# EAGLE design tiny13_charlie4_50mm_AAA_optical_diag_SMT (EAGLE 6.2)
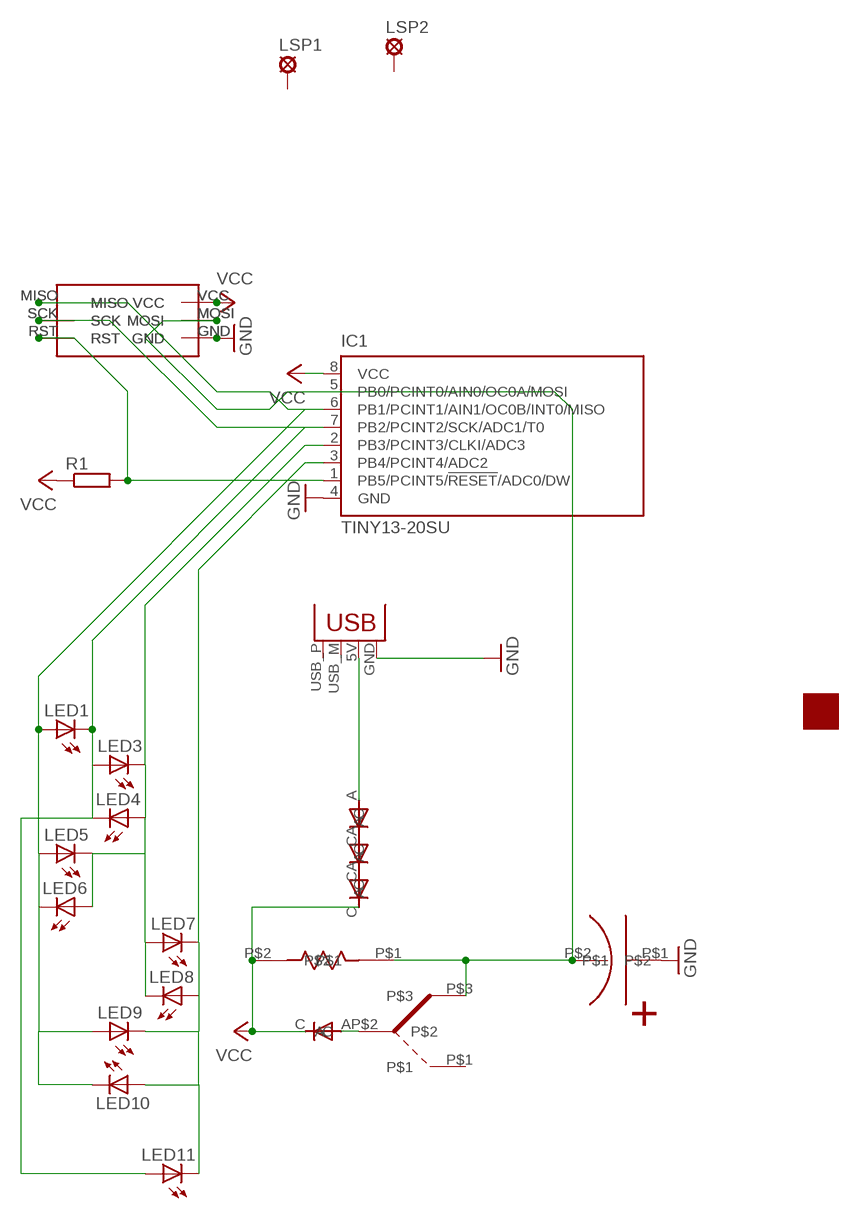
[diagram p0: schematic, sheet 1]

## Parts
IC1  TINY13-20SU  [8S2]
LED1  LED3MM  [LED3MM]
LED3  LED3MM  [LED3MM]
LED4  LED3MM  [LED3MM]
LED5  LED3MM  [LED3MM]
LED6  LED3MM  [LED3MM]
LED7  LED3MM  [LED3MM]
LED8  LED3MM  [LED3MM]
LED9  LED3MM  [LED3MM]
LED10  LED3MM  [LED3MM]
LED11  LED3MM  [LED3MM]
LSP1  LSP10  [LSP10]
LSP2  LSP10  [LSP10]
R1  R-EU_0204/5  [0204/5]
U$1  R-6  [R-6]
U$2  D-6  [D-7.5]
U$3  D-6  [D-7.5]
U$4  AVR_ISP_6_PIN_1X6_SMT_SQUARE_ROUNDED  [CONTACT_ISP_1X6_SQUARE_PAD_ROUNDED]
U$5  NICHICON_12F  [NICHICON_10X30]
U$6  D-6  [D-7.5]
U$7  D-6  [D-7.5]
U$8  SPST_SWITCH_MICRO_PTH  [SPSTMICRO]
U$9  AVR_ISP_6_PIN_1X6_SMT_SQUARE_ROUNDED  [CONTACT_ISP_1X6_SQUARE_PAD_ROUNDED]
U$10  LOGO  [LOGO]
X1  USBPCB  [USB-A-PCB]

## Nets
GND: IC1.4(GND) U$4.GND U$5.P$1 U$9.GND X1.GND
N$1: IC1.2(PB3/PCINT3/CLKI/ADC3) LED3.K(C) LED4.A LED5.K(C) LED6.A LED7.A LED8.K(C)
N$2: IC1.7(PB2/PCINT2/SCK/ADC1/T0) LED1.K(C) LED3.A LED4.K(C) LED11.A U$4.SCK U$9.SCK
N$3: U$7.A U$8.P$2
N$4: IC1.3(PB4/PCINT4/ADC2) LED7.K(C) LED8.A LED9.K(C) LED10.A LED11.K(C)
N$6: IC1.1(PB5/PCINT5/!RESET!/ADC0/DW) R1.2 U$4.RST U$9.RST
N$8: IC1.6(PB1/PCINT1/AIN1/OC0B/INT0/MISO) LED1.A LED5.A LED6.K(C) LED9.A LED10.K(C) U$4.MISO U$9.MISO
N$9: IC1.5(PB0/PCINT0/AIN0/OC0A/MOSI) U$1.P$1 U$4.MOSI U$5.P$2 U$8.P$3 U$9.MOSI
N$11: U$2.C U$3.A
N$12: U$3.C U$6.A
N$13: U$2.A X1.5V(VBUS)
VCC: IC1.8(VCC) R1.1 U$1.P$2 U$4.VCC U$6.C U$7.C U$9.VCC
Unconnected: LSP1.MP LSP2.MP U$8.P$1 X1.USB_M(D-) X1.USB_P(D+)

## Library data of the parts
IC1 = atmel:TINY13: 8-bit AVR Microcontroller with 1K Bytes In-System Programmable Flash Source: http://www.atmel.com/dyn/resources/prod_documents/2535S.pdf; MPN: ATTINY13-20SU; OC_FARNELL: 9171568; OC_NEWARK: 96K6522
LED1 LED3-LED11 = 0-svo:LED: LED OSRAM: - CHIPLED LG R971, LG N971, LY N971, LG Q971, LY Q971, LO R971, LY R971 LH N974, LH R974 LS Q976, LO Q976, LY Q976 LO Q996 - Hyper CHIPLED LW Q18S LB Q993, LB Q99A, LB R99A - SideLED LS A670, LO A670, LY A670, LG A670, LP A670 LB A673, LV A673, LT A673, LW A673 LH A674 LY A675 LS A676, LA A676, LO A676, LY A676, LW A676 LS A679, LY A679, LG A679 - Hyper Micro SIDELED® LS Y876, LA Y876, LO Y876, LY Y876 LT Y87S - SmartLED LW L88C, LW L88S LB L89C, LB L89S, LG L890 LS L89K, LO L89K, LY L89K LS L896, LA L896, LO L896, LY L896 - TOPLED LS T670, LO T670, LY T670, LG T670, LP T670 LSG T670, LSP T670, LSY T670, LOP T670, LYG T670 LG T671, LOG T671, LSG T671 LB T673, LV T673, LT T673, LW T673 LH T674 LS T676, LA T676, LO T676, LY T676, LB T676, LH T676, LSB T676, LW T676 LB T67C, LV T67C, LT T67C, LS T67K, LO T67K, LY T67K, LW E67C LS E67B, LA E67B, LO E67B, LY E67B, LB E67C, LV E67C, LT E67C LW T67C LS T679, LY T679, LG T679 LS T770, LO T770, LY T770, LG T770, LP T770 LB T773, LV T773, LT T773, LW T773 LH T774 LS E675, LA E675, LY E675, LS T675 LS T776, LA T776, LO T776, LY T776, LB T776 LHGB T686 LT T68C, LB T68C - Hyper Mini TOPLED® LB M676 - Mini TOPLED Santana® LG M470 LS M47K, LO M47K, LY M47K Source: http://www.osram.convergy.de/
LSP1 LSP2 = solpad:LSP10: SOLDER PAD drill 1.0 mm, distributor Buerklin, 12H555
R1 = resistor:R-EU_: RESISTOR, European symbol
U$1 = Mrule:R-6
U$2 U$3 U$6 U$7 = Mrule:D-6
U$4 U$9 = Mrule:AVR_ISP_6_PIN_1X6_SMT_SQUARE_ROUNDED
U$5 = Mrule:NICHICON_12F
U$8 = Mrule:SPST_SWITCH_MICRO_PTH
U$10 = mrule2:LOGO
X1 = SparkFun:USB: USB Connectors USB-B-PTH is fully proven SKU : PRT-00139 USB-miniB is fully proven SKU : PRT-00587 USB-A-PCB is untested. USB-A-H is throughly reviewed, but untested. Spark Fun Electronics SKU : PRT-00437 USB-B-SMT is throughly reviewed, but untested. Needs silkscreen touching up. USB-A-S has not been used/tested USB-MB-H has not been used/tested

## Board
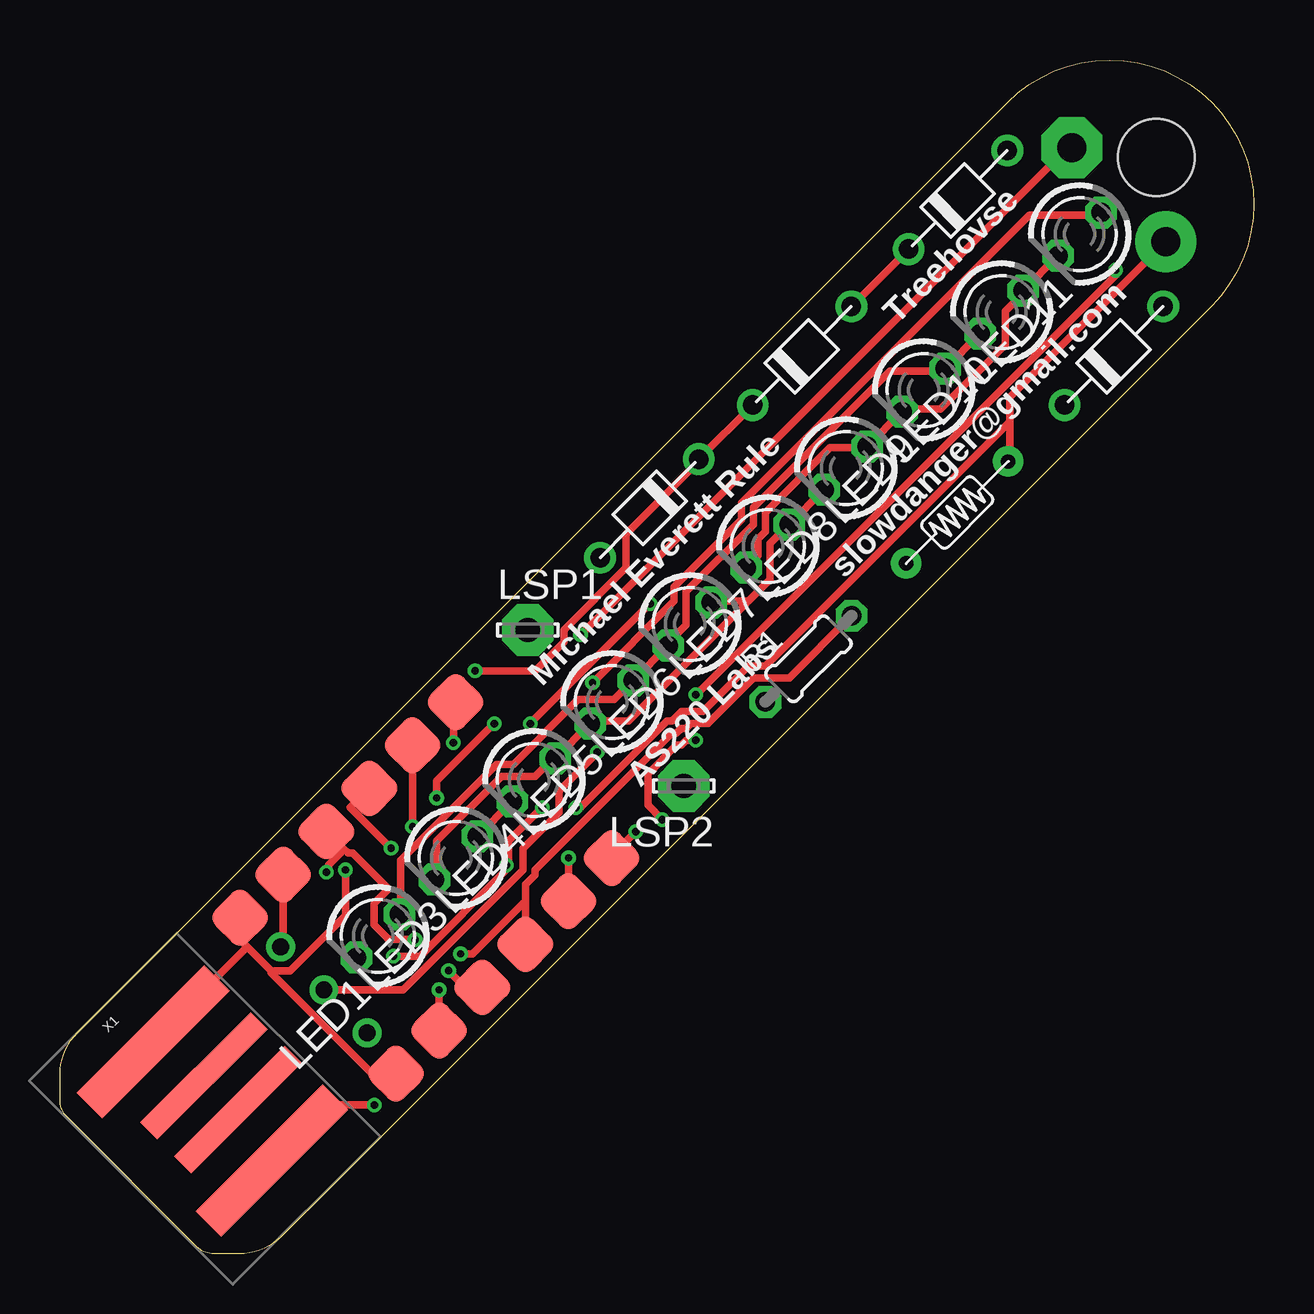
[diagram p1: board, top side]
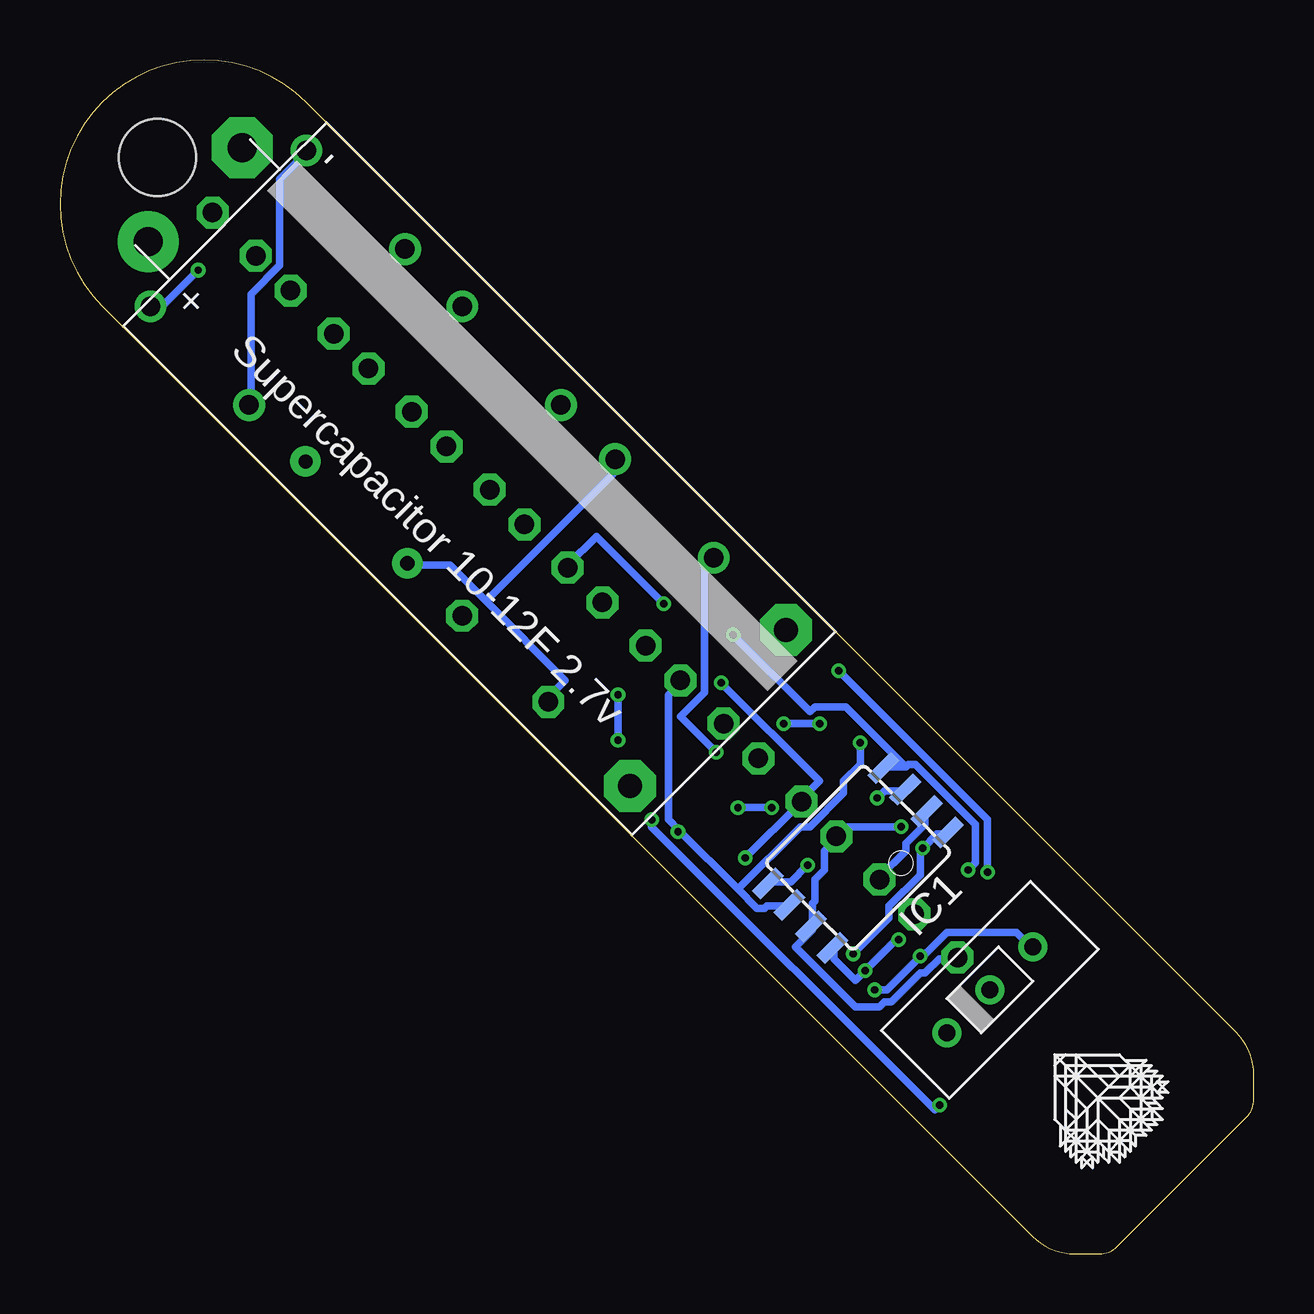
[diagram p2: board, bottom side, seen from below]

Size 49.76 x 49.76 mm. Coordinates in mm from the lower left corner, seen from the top.
Outline: 0.73,9.23 39.5,48 arc-180 48,39.5 9.23,0.73 arc-45 7.46,0 6.41,0 arc-45 5.71,0.29 0.29,5.71 arc-45 0,6.41 0,7.46 arc-45 0.73,9.23
Copper layers (1*16): Top 0.035mm / dielectric 1.5mm / Bottom 0.035mm
Design rules: minimum track width 12mil, minimum drill 12mil, track to track 7mil, track to pad 7mil, pad to pad 7mil, via to via 7mil, smd to smd 0mil, copper to edge 20mil, drill to drill 10mil, minimum pad ring 10mil, minimum via ring 6mil, stop-mask expansion 2mil, vias tented up to drill 100mil, thermal gap 10mil
Holes 3.2 mm at 45.7,45.7

### Footprints (pad centres in the part's own frame; a part is rotated, then mirrored left to right if it is on the bottom)
8S2 = smd 0.5 x 1.4: 1 -1.905,-3.404; 2 -0.645,-3.404; 3 0.625,-3.404; 4 1.895,-3.404; 5 1.905,3.404; 6 0.635,3.404; 7 -0.635,3.404; 8 -1.905,3.404
LED3MM = drill 0.813 octagon: A -1.27,0; K 1.27,0
LSP10 = drill 1.016 pad 2.159 octagon: MP 0,0
0204/5 = drill 0.813 octagon: 1 -2.54,0; 2 2.54,0
R-6 = drill 0.6 pad 1.27: P$1 -3,0; P$2 3,0
D-7.5 = drill 0.813: A 2.81,0; C -3,0
CONTACT_ISP_1X6_SQUARE_PAD_ROUNDED = smd 1.93 x 1.93: GND 6.35,0; MISO -6.35,0; MOSI 3.81,0; RST -1.27,0; SCK -3.81,0; VCC 1.27,0
NICHICON_10X30 = drill 1.2 pad 2.54 octagon: P$1 3.23,-1.75 | drill 1.2 pad 2.54: P$2 8.77,-1.75
SPSTMICRO = drill 0.7: P$1 -2.54,0; P$2 0,0; P$3 2.54,0
USB-A-PCB = smd 7.5 x 1.5: 5V -0.2,-3.5; GND -0.2,3.5 | smd 6.5 x 1: USB_M 0.3,-1; USB_P 0.3,1

### Placement (x,y rotation side)
IC1  16.5,16.5 135 bottom
LED1  13.25,13.25 225 top
LED3  16.5,16.5 225 top
LED4  19.75,19.75 225 top
LED5  23,23 225 top
LED6  26.25,26.25 225 top
LED7  29.5,29.5 225 top
LED8  32.75,32.75 225 top
LED9  36,36 225 top
LED10  39.25,39.25 225 top
LED11  42.5,42.5 225 top
LSP1  19.5,26 0 top
LSP2  26,19.5 180 top
R1  31.2,24.8 45 top
U$1  37.4,30.9 225 top
U$2  44,37.5 45 top
U$3  37.5,44 45 top
U$4  18.5,12 225 top
U$5  38.65,47.15 225 bottom
U$6  31,37.5 45 top
U$7  24.5,31 225 top
U$8  11,11 45 bottom
U$9  12,18.5 225 top
U$10  6.5,6.5 225 bottom
X1  6.5,6.5 45 top

### Tracks (layer width: path | path; a pad name or v marks a point on that pad's centre or on a via)
GND  (via drill 0.3)
  Top 0.305: v11.9,16 11.9,14.1 9.6,11.8 8.8,11.8 | 7.8,12.8 7.1,13.5 7.6,14 U$9.GND | 7.8,12.8 8.8,11.8 | U$4.GND 14,7.6 12.9,7.6 8.8,11.7 8.8,11.8 | v21.7,25.8 42,46.1 42.1,46.1 U$5.P$1 | 7.8,12.8 3.9,8.9 X1.GND
  Bottom 0.305: 14.6,20.3 14.5,20.3 14.4,20.4 14.1,20.4 11.6,17.9 11.6,16.3 v11.9,16 | 14.6,20.3 15.4,20.3 IC1.4 | v21.7,25.8 18.5,22.6 18.3,22.8 17,22.8 14.6,20.4 14.6,20.3
N$1
  Top 0.305: 28.6,27.2 28.7,27.2 29.6,28.1 29.6,29.6 LED7.A LED8.K | 28.6,27.2 27.2,27.2 LED6.A | 28.6,27.2 28.6,27.1 23.7,22.2 22.2,22.2 LED5.K LED4.A 20.5,20.6 19.8,19.9 18.4,19.9 15.7,17.2 15.7,15.7 LED3.K
  Bottom 0.305: IC1.2 13.7,18.4 13.7,17.9 14.5,17.1 14.5,16.8 15.6,15.7 LED3.K
N$2  (via drill 0.3)
  Top 0.305: v14.7,17.8 14.7,21.1 U$9.SCK | v21.2,16.5 U$4.SCK | v22.2,23.8 25.6,27.2 25.6,27.8 28.4,30.6 28.4,31.3 40.4,43.3 43.3,43.3 LED11.A | LED4.K LED3.A
  Bottom 0.305: v14.7,17.8 17,17.8 17.3,17.5 LED3.A 17.4,17.3 17.9,16.8 17.9,16 18.3,15.6 18.3,14.7 18.4,14.6 18.4,13.7 IC1.7 18.4,13.5 19.1,12.8 16.6,10.3 15.6,10.3 15.4,10.5 15.1,10.5 13.9,11.7 13.7,11.7 13.1,12.3 12.4,12.3 LED1.K | v21.2,16.5 18.9,18.8 LED4.K 18.8,19 18.1,19.7 v22.2,23.8
N$3  (via drill 0.3)
  Top 0.305: U$8.P$2 14.3,11 19.3,16 19.3,16.9 20.8,18.4 20.8,19.3 v22.4,20.9
  Bottom 0.305: v22.4,20.9 23.9,22.4 22.9,23.4 22.9,28.7 22.6,29 U$7.A
N$4  (via drill 0.3)
  Top 0.305: LED11.K LED10.A 40.1,40 39.4,39.3 39.4,37.9 36.7,35.2 35.2,35.2 LED9.K LED8.A 33.5,33.6 32.1,33.6 29.4,30.9 29.4,30.1 29.1,29.8 29.1,29.1 LED7.K | v15.7,19 15.7,19.7 v18.1,22.1 | v24.6,27.1 v19.6,22.1
  Bottom 0.305: v15.7,19 15.4,19.3 14.6,19.3 IC1.3 | v19.6,22.1 v18.1,22.1 | v24.6,27.1 27.4,29.9 28.6,28.7 LED7.K
N$6  (via drill 0.3)
  Top 0.305: v13.8,16.9 12.1,18.6 U$9.RST | 19.4,14.6 19.4,15.4 19.8,15.8 19.8,16 25.5,21.7 25.7,21.7 25.9,21.9 26.1,21.9 26.3,22.1 27,22.1 28.9,24 30.4,24 R1.2 | 19.4,14.6 U$4.RST | v16.7,12.5 17.2,12.5 19.3,14.6 19.4,14.6
  Bottom 0.305: IC1.1 12.8,17.5 13.2,17.5 v13.8,16.9 13.9,16.8 13.9,15.8 15.2,14.5 15.2,14 v16.7,12.5
N$8  (via drill 0.3)
  Top 0.305: LED10.K LED9.A 36.8,36.8 34.6,36.8 28.9,31.1 28.9,30.4 26.1,27.6 26.1,26.2 25.4,25.5 LED6.K LED5.A 23.1,23.1 21.6,23.1 18.9,20.4 18.2,20.4 14.2,16.4 14.2,14.2 LED1.A | v24,17.6 23,16.6 U$4.MISO | v16.4,21.3 16.4,22.9 U$9.MISO
  Bottom 0.305: 23.95,17.65 24.4,18.1 24.4,23.3 23.9,23.8 LED5.A | 23.95,17.65 21.5,15.2 | 21.5,15.2 20.7,14.4 20.4,14.4 20.3,14.5 19.4,14.5 IC1.6 | v24,17.6 23.95,17.65 | v16.4,21.3 16.4,20.4 17.1,19.7 17.1,19.2 18.5,17.8 18.9,17.8 21.5,15.2
N$9  (via drill 0.3)
  Top 0.305: v13.9,12.4 15,12.4 18.6,16 v18.6,16.2 18.7,16.3 18.7,17.2 v20.1,18.6 | U$9.MOSI 9.3,12.8 U$8.P$3 | v15.8,11 15.8,9.4 U$4.MOSI | 39.6,34.6 39.6,35.7 46,42.1 U$5.P$2 | 39.6,34.6 39.6,33.1 U$1.P$1 | v21.5,18.6 21.7,18.6 25.3,22.2 25.5,22.2 25.9,22.6 26.8,22.6 28.7,24.5 29.4,24.5 39.5,34.6 39.6,34.6
  Bottom 0.305: v18.6,16.2 19.3,15.5 20.2,15.5 IC1.5 | U$8.P$3 9.3,12.8 9.9,13.4 12.8,13.4 13.8,12.4 v13.9,12.4 15.3,11 v15.8,11 | v21.5,18.6 v20.1,18.6
N$11
  Bottom 0.305: U$2.C 41.8,35.4 41.8,40 40.6,41.2 40.6,44.8 39.5,45.9 U$3.A
N$12
  Top 0.305: U$3.C U$6.A
N$13  (via drill 0.3)
  Top 0.305: v44,41 44,40.8 v26.5,23.3 | v26.5,21.4 26.1,21.4 25.9,21.2 25.7,21.2 24.5,20 24.5,18.7 v25.1,18.1 | v13.1,6.2 11.2,6.2 8.9,3.9 X1.5V
  Bottom 0.305: v44,41 45.5,39.5 45.9,39.5 U$2.A | v26.5,21.4 v26.5,23.3 | v25.1,18.1 25.1,17.8 13.3,6 v13.1,6.2
VCC  (via drill 0.3)
  Top 0.305: U$9.VCC 11.2,17.5 11.8,16.9 | v16.2,11.8 17.2,10.8 17.6,11.2 U$4.VCC | 11.8,16.9 12,16.7 12.2,16.7 13.7,15.2 13.1,14.6 13.1,13.7 13.7,13.1 v14.8,13.1 | U$6.C U$7.C 26.6,33 23.6,30 23.6,28.6 21,26 21,25.5 19.8,24.3 v17.3,24.3 | v11.1,15.9 11.2,16 11.2,16.2 11.7,16.7 11.7,16.8 11.8,16.9
  Bottom 0.305: IC1.8 17.5,12.7 17.5,12.3 16.6,11.4 v16.2,11.8 14.9,13.1 v14.8,13.1 | 32,27.2 28.7,23.9 29.5,23.1 R1.1 | 32,27.2 33.5,28.7 35.2,28.7 U$1.P$2 | 32,27.2 26.7,32.5 26.7,33.1 U$7.C | v11.1,15.9 11.1,18.1 v17.3,24.3

### Text on the board
tPlace: Treehovse | slowdanger@gmail.com | Michael Everett Rule | AS220 Labs